# EasyEDA schematic SCH_macropad-pcb_2024-06-17.json
TITLE: Sheet_1; REV: 1.0; Date: 2024-06-17; Sheet: 1/1; Drawn By: elberto22; Company: Your Company
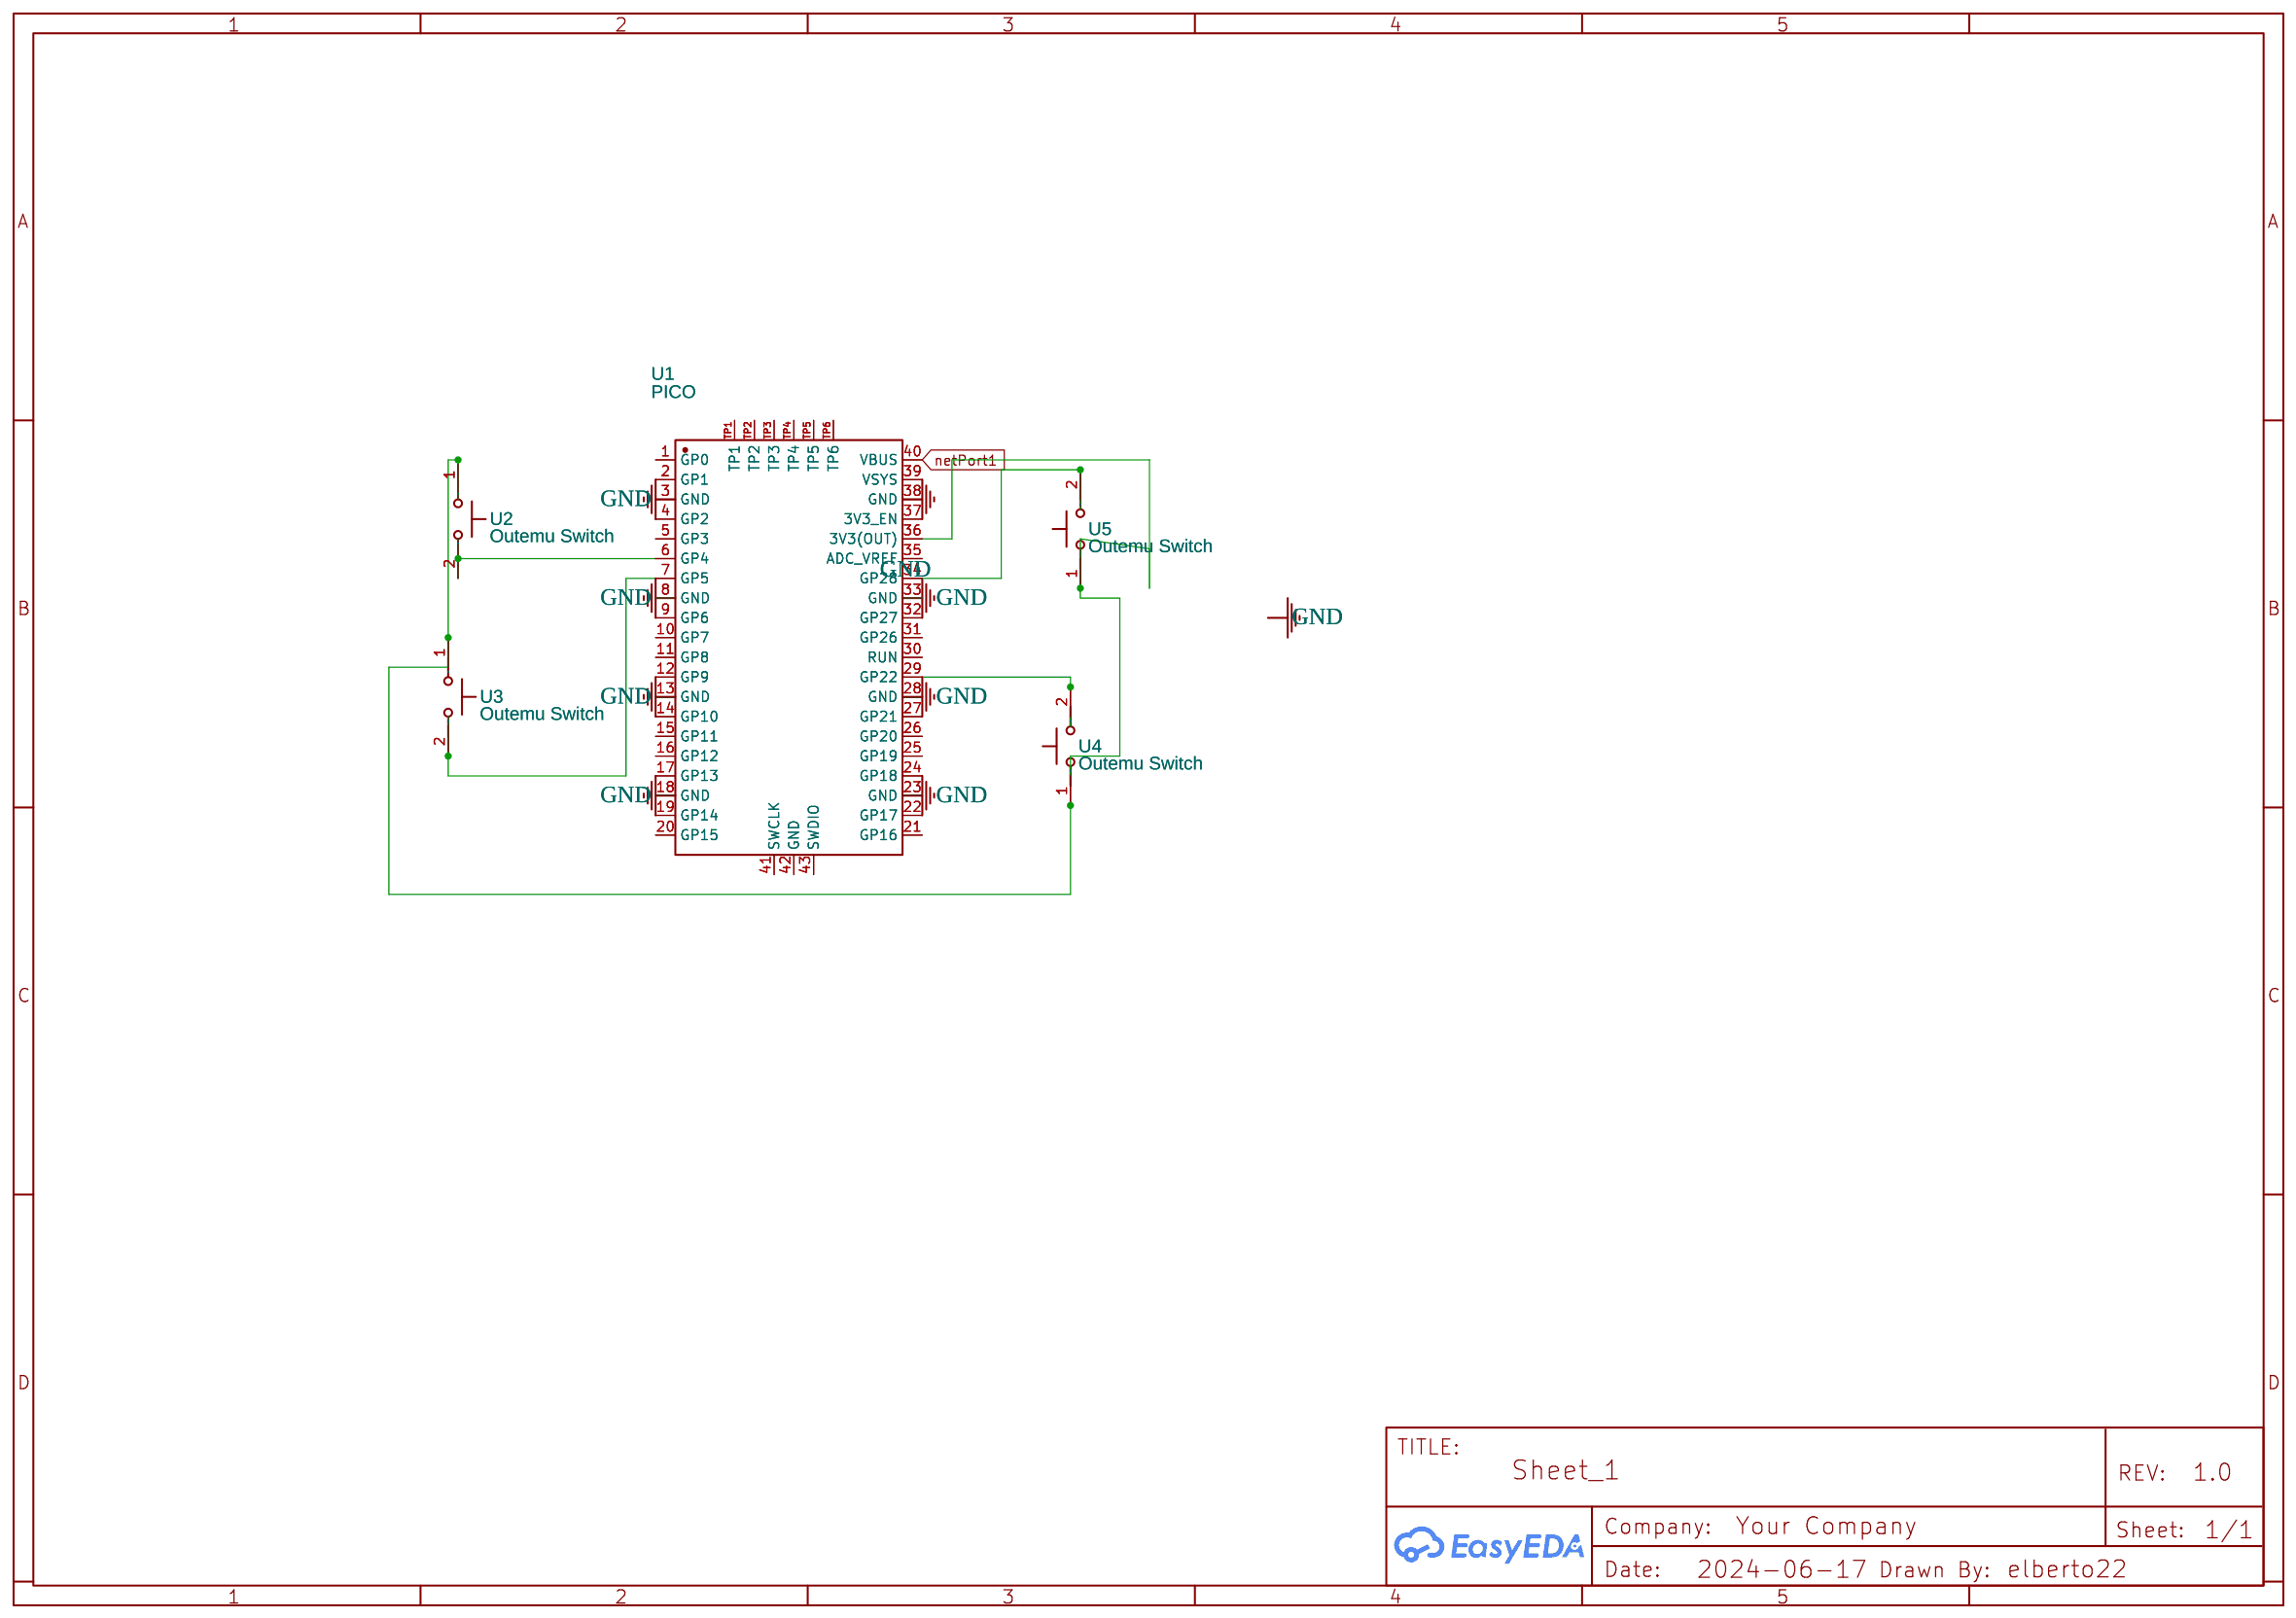
[diagram p0: schematic sheet]

## Parts
U1  PICO  [COMM-SMD_L51.0-W21.0-P2.54_SC0916]
U2  Outemu Switch  [OUTEMU SWITCH]
U3  Outemu Switch  [OUTEMU SWITCH]
U4  Outemu Switch  [OUTEMU SWITCH]
U5  Outemu Switch  [OUTEMU SWITCH]

## Library data of the parts
U1 = PICO: Supplier: LCSC; Supplier Part: C7203002; Manufacturer: Raspberry Pi(树莓派); JLCPCB Part Class: Extended Part; Contributor: lcsc
U2-U5 = Outemu Switch: Manufacturer: HepLer; Supplier: Others; Contributor: QUEBO MTB

## Nets
GND: U1.8(GND) U1.13(GND) U1.18(GND) U1.23(GND) U1.28(GND) U1.33(GND)
netPort1: U1.40(VBUS)
Net-(U1-6): U1.6(GP4) U2.2
Net-(U1-7): U1.7(GP5) U3.2
Net-(U1-29): U1.29(GP22) U4.2
Net-(U1-34): U1.34(GP28) U5.2
Net-(U1-36): U1.36(3V3(OUT)) U2.1 U3.1 U4.1 U5.1

Not connected (* = marked no-connect by the designer): U1 1(GP0) 2(GP1) 3(GND) 4(GP2) 5(GP3) 9(GP6) 10(GP7) 11(GP8) 12(GP9) 14(GP10) 15(GP11) 16(GP12) 17(GP13) 19(GP14) 20(GP15) 21(GP16) 22(GP17) 24(GP18) 25(GP19) 26(GP20) 27(GP21) 30(RUN) 31(GP26) 32(GP27) 35(ADC_VREF) 37(3V3_EN) 38(GND) 39(VSYS) 41(SWCLK) 42(GND) 43(SWDIO) TP1 TP2 TP3 TP4 TP5 TP6
